# EAGLE design leptonBreakoutV4 (EAGLE 6.6.0)
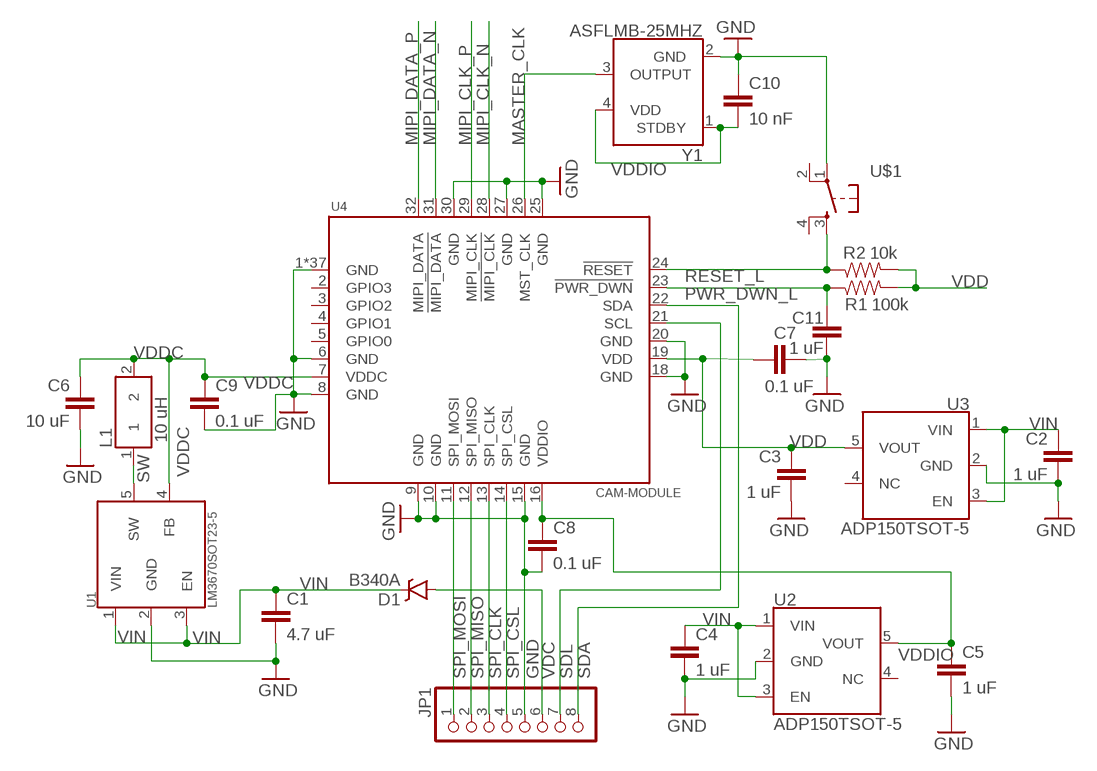
[diagram p0: schematic, sheet 1]

## Parts
C1  4.7 uF  CAP0805  [0805]
C2  1 uF  CAP0805  [0805]
C3  1 uF  CAP0805  [0805]
C4  1 uF  CAP0805  [0805]
C5  1 uF  CAP0805  [0805]
C6  10 uF  CAP0805  [0805]
C7  0.1 uF  CAP0805  [0805]
C8  0.1 uF  CAP0805  [0805]
C9  0.1 uF  CAP0805  [0805]
C10  10 nF  CAP0805  [0805]
C11  1 uF  CAP0805  [0805]
D1  B340A  DIODE-SCHOTTKY-B340A  [SMA-DIODE]
JP1  PINHD-1X8/90  [1X08/90]
L1  10 uH  SMD-INDUCTOR  [SMD-INDUCTOR]
R1  100k  RESISTOR0805-RES  [0805]
R2  10k  RESISTOR0805-RES  [0805]
U1  LM3670SOT23-5  [SOT23-5]
U2  ADP150TSOT-5  [SOT23-5]
U3  ADP150TSOT-5  [SOT23-5]
U4  CAM-MODULE  [CAM-SOCKET]
U$1  TACTILE-SWITCH-7914G  [7914G]
Y1  ASFLMB-25MHZ  [5X3.2-CRYSTAL-OSC]

## Nets
GND: C1.2 C2.2 C3.2 C4.2 C5.2 C6.2 C7.2 C8.2 C9.2 C10.1 C11.2 JP1.5 U1.2(GND) U2.2(GND) U3.2(GND) U4.1(GND) U4.6(GND) U4.8(GND) U4.9(GND) U4.10(GND) U4.15(GND) U4.18(GND) U4.20(GND) U4.25(GND) U4.27(GND) U4.30(GND) U4.P$1(GND) U4.P$2(GND) U4.P$3(GND) U4.P$4(GND) U4.P$5(GND) U4.P$6(GND) U4.P$7(GND) U4.P$8(GND) U4.P$9(GND) U4.P$10(GND) U4.P$11(GND) U4.P$12(GND) U4.P$13(GND) U4.P$14(GND) U4.P$15(GND) U4.P$16(GND) U4.P$17(GND) U4.P$18(GND) U4.P$19(GND) U4.P$20(GND) U4.P$21(GND) U4.P$22(GND) U4.P$23(GND) U4.P$24(GND) U4.P$25(GND) U4.P$26(GND) U4.P$27(GND) U4.P$28(GND) U4.P$29(GND) U4.P$30(GND) U4.P$31(GND) U4.P$32(GND) U4.P$33(GND) U4.P$34(GND) U4.P$35(GND) U4.P$36(GND) U$1.1 Y1.2(GND)
MASTER_CLK: U4.26(MST_CLK) Y1.3(OUTPUT)
MIPI_CLK_N: U4.28(!MIPI_CLK)
MIPI_CLK_P: U4.29(MIPI_CLK)
MIPI_DATA_N: U4.31(!MIPI_DATA)
MIPI_DATA_P: U4.32(MIPI_DATA)
PWR_DWN_L: C11.1 R1.1 U4.23(!PWR_DWN)
RESET_L: R2.1 U4.24(!RESET) U$1.3
SDA: JP1.8 U4.22(SDA)
SDL: JP1.7 U4.21(SCL)
SPI_CLK: JP1.3 U4.13(SPI_CLK)
SPI_CSL: JP1.4 U4.14(SPI_CSL)
SPI_MISO: JP1.2 U4.12(SPI_MISO)
SPI_MOSI: JP1.1 U4.11(SPI_MOSI)
SW: L1.1 U1.5(SW)
VDC: D1.A JP1.6
VDD: C3.1 C7.1 R1.2 R2.2 U3.5(VOUT) U4.19(VDD)
VDDC: C6.1 C9.1 L1.2 U1.4(FB) U4.7(VDDC)
VDDIO: C5.1 C8.1 C10.2 U2.5(VOUT) U4.16(VDDIO) Y1.1(STDBY) Y1.4(VDD)
VIN: C1.1 C2.1 C4.1 D1.C U1.1(VIN) U1.3(EN) U2.1(VIN) U2.3(EN) U3.1(VIN) U3.3(EN)
Unconnected: U2.4(NC) U3.4(NC) U4.2(GPIO3) U4.3(GPIO2) U4.4(GPIO1) U4.5(GPIO0) U$1.2 U$1.4

## Notes on the sheet
- C:/Users/User/Desktop/test.bmp | C:/Users/User/Desktop/test.bmp

## Library data of the parts
C1-C11 = SparkFun-Capacitors:CAP: Capacitor Standard 0603 ceramic capacitor, and 0.1" leaded capacitor.
D1 = leptonCustom:DIODE-SCHOTTKY: Schottky diodes in SFE's production catalog BAT20J 1A 23V 0.62Vf RB751 120mA 40V 0.37Vf PMEG4005EJ 0.5A 40V 0.42Vf MBRA140 1A 40V 0.5Vf B340A 3A 40V SMA; PROD_ID: DIO-09886
JP1 = pinhead:PINHD-1X8: PIN HEADER
L1 = leptonCustom:SMD-INDUCTOR
R1 R2 = SparkFun-Resistors:RESISTOR: Resistor Basic schematic elements and footprints for 0603, 1206, and PTH resistors.
U1 = leptonCustom:LM3670: LM3670 1.2V 350mA Mini Buck Converter TI LM3670MF-1.2/NOPB
U2 U3 = leptonCustom:ADP150: ADP150 2.8V 150mA Linear LDO Regulator Analog Devices ADP150AUJZ-2.8-R7
U4 = leptonCustom:CAM-MODULE: FLIR Lepton 80x60 LWIR camera module.
U$1 = GeekAmmo:TACTILE-SWITCH: Tactile Switch 4 Pins, SPST NO
Y1 = leptonCustom:ASFLMB-25MHZ: 25 MHz crystal oscillator.

## Board
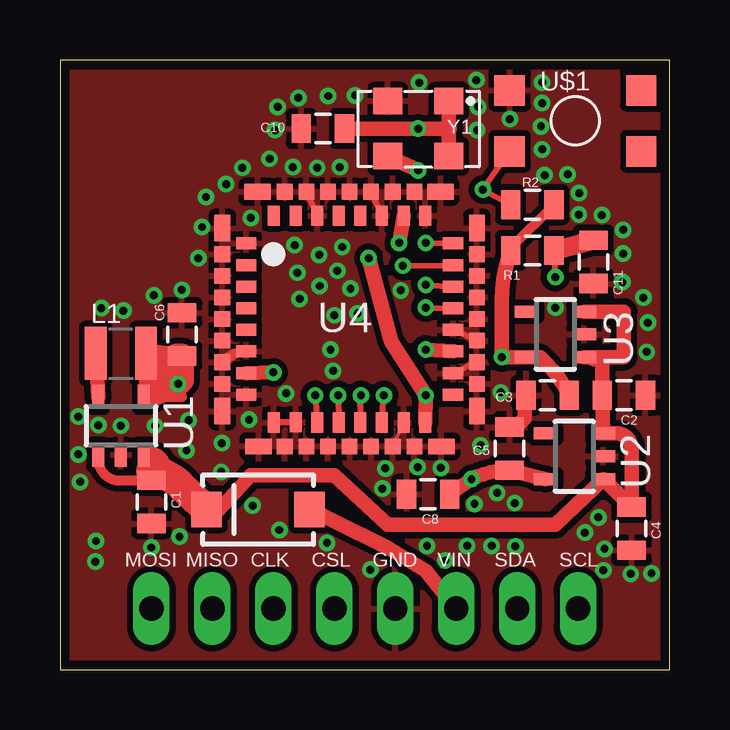
[diagram p1: board, top side]
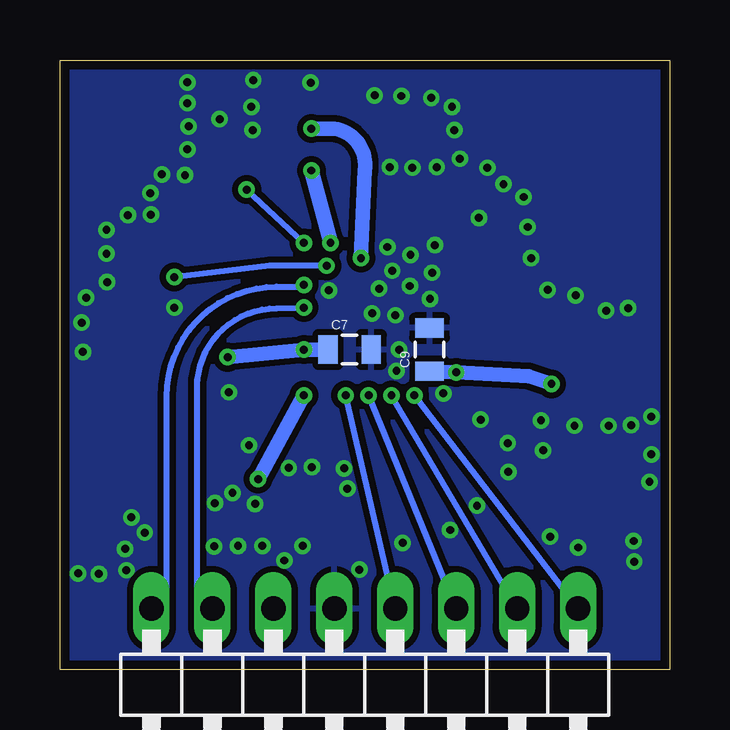
[diagram p2: board, bottom side, seen from below]

Size 25.4 x 25.4 mm. Coordinates in mm from the lower left corner, seen from the top.
Outline: 0,0 25.4,0 25.4,25.4 0,25.4 0,0
Copper layers (1*16): Top 0.0356mm / dielectric 1.5011mm / Bottom 0.0356mm
Design rules "LaenPCBOrder *": minimum track width 6mil, minimum drill 13mil, track to track 6mil, track to pad 6mil, pad to pad 6mil, via to via 6mil, smd to smd 6mil, copper to edge 15mil, drill to drill 6mil, minimum pad ring 7mil, minimum via ring 7mil, stop-mask expansion 3mil, vias tented up to drill 13mil, thermal gap 10mil

### Footprints (pad centres in the part's own frame; a part is rotated, then mirrored left to right if it is on the bottom)
0805 = smd 0.8 x 1.2: 1 -0.9,0; 2 0.9,0
SMA-DIODE = smd 1.27 x 1.47: A -2.15,0; C 2.15,0
1X08/90 = drill 1.016 long: 1 -8.89,-3.81; 2 -6.35,-3.81; 3 -3.81,-3.81; 4 -1.27,-3.81; 5 1.27,-3.81; 6 3.81,-3.81; 7 6.35,-3.81; 8 8.89,-3.81
SMD-INDUCTOR = smd 0.9 x 2.2: 1 -1.05,0; 2 1.05,0
SOT23-5 = smd 0.5 x 1: 1 -0.95,-1.2; 2 0,-1.2; 3 0.95,-1.2; 4 0.95,1.2; 5 -0.95,1.2
CAM-SOCKET = smd 0.5 x 0.84: 1 -3.15,-4.31; 2 -2.25,-4.31; 3 -1.35,-4.31; 4 -0.45,-4.31; 5 0.45,-4.31; 6 1.35,-4.31; 7 2.25,-4.31; 8 3.15,-4.31; 17 3.15,4.31; 18 2.25,4.31; 19 1.35,4.31; 20 0.45,4.31; 21 -0.45,4.31; 22 -1.35,4.31; 23 -2.25,4.31; 24 -3.15,4.31 | smd 0.84 x 0.5: 9 4.31,-3.15; 10 4.3,-2.25; 11 4.31,-1.35; 12 4.31,-0.45; 13 4.31,0.45; 14 4.31,1.35; 15 4.31,2.25; 16 4.31,3.15; 25 -4.31,3.15; 26 -4.31,2.25; 27 -4.31,1.35; 28 -4.31,0.45; 29 -4.31,-0.45; 30 -4.31,-1.35; 31 -4.31,-2.25; 32 -4.31,-3.15 | smd 0.65 x 0.65: P$1 -5.305,2.7; P$3 -5.305,1.8; P$4 -5.305,0.9; P$5 -5.305,0; P$6 -5.305,-0.9; P$7 -5.305,-1.8; P$8 -5.305,-2.7; P$11 -2.7,5.305; P$12 -1.8,5.305; P$13 -0.9,5.305; P$14 0,5.305; P$15 0.9,5.305; P$16 1.8,5.305; P$17 2.7,5.305; P$20 5.305,-2.7; P$21 5.305,-1.8; P$22 5.305,-0.9; P$23 5.305,0; P$24 5.305,0.9; P$25 5.305,1.8; P$26 5.305,2.7; P$29 -2.7,-5.305; P$30 -1.8,-5.305; P$31 -0.9,-5.305; P$32 0,-5.305; P$33 0.9,-5.305; P$34 1.8,-5.305; P$35 2.7,-5.305 | smd 0.65 x 1.1: P$2 -5.305,-3.83; P$9 -5.305,3.79; P$19 5.305,3.83; P$27 5.305,-3.79 | smd 1.1 x 0.65: P$10 3.83,5.305; P$18 -3.79,5.305; P$28 3.83,-5.305; P$36 -3.79,-5.305
7914G = smd 1.27 x 1.27: 1 0,0; 2 0,5.486; 3 2.54,0; 4 2.54,5.486
5X3.2-CRYSTAL-OSC = smd 1.2 x 1.1: 1 -1.27,-1.15; 2 1.27,-1.15; 3 1.27,1.15; 4 -1.27,1.15

### Placement (x,y rotation side)
C1  3.81,6.99 270 top
C2  23.5,11.43 0 top
C3  20.32,11.43 180 top
C4  23.81,5.87 270 top
C5  18.73,9.21 90 top
C6  5.08,13.97 90 top
C7  13.34,13.34 0 bottom
C8  15.34,7.3 180 top
C9  10,13.34 90 bottom
C10  10.95,22.54 0 top
C11  22.23,16.99 270 top
D1  8.26,6.67 180 top
JP1  12.7,-1.27 180 bottom
L1  2.54,13.18 0 top
R1  19.68,17.46 180 top
R2  19.68,19.37 0 top
U1  2.54,10.16 0 top
U2  21.43,8.89 90 top
U3  20.64,13.97 90 top
U4  12.06,14.61 270 top
U$1  18.73,24.13 270 top
Y1  14.92,22.54 180 top

### Tracks (layer width: path | path; a pad name or v marks a point on that pad's centre or on a via)
GND  (via drill 0.33, 0.33 pad 0.61)
  Top 0.152: U4.P$25 U4.15
  Top 0.254: U4.20 U4.P$15 | U4.10 U4.9 | U4.27 U4.P$4 | U4.30 U4.P$7 | U4.18 U4.P$16
  Top 0.406: U4.P$34 arc-45 U4.6
  Top 0.61: 19.05,10.16 19.37,10.48 19.37,11.43
  other vias: 20.64,15.08 2.54,10.16 9.78,17.68 7.59,20.91 9.7,20.94 11.18,23.9 12.29,23.93 11.76,17.61 12.1,15.88 23.44,16.14 23.46,17.34 23.46,18.33 21.15,20.64 20.09,21.67 21.62,18.95 20.19,20.61 20.09,23.6 24.31,15.5 20.04,22.64 20.09,24.47 24.5,14.46 5.36,10.39 6.74,9.44 1.5,5.36 1.47,4.5 3.81,5.09 22.43,6.34 22.64,4.14 6.08,19.69 9.89,16.54 11.27,13.34 11.43,14.76 0.84,7.82 1.6,10.19 0.76,8.97 0.76,10.54 3.91,15.6 1.73,15.06 2.64,14.96 8.03,6.83 9.14,5.82 11.13,5.28 15.29,5.16 16.97,5.16 16.05,4.55 18.21,7.37 17.53,9.35 9.07,23.44 4.98,5.54 5.77,17.14 5.92,18.44 5.08,15.82 7.87,10.41 7.95,18.82 14.2,15.8 12.4,14.84 6.72,8.24 3.96,10.16 21.87,5.71 24.64,4.01 14.96,24.46 17.35,24.56 17.42,23.44 10.72,20.91 11.66,20.94 6.92,20.22 8.97,22.48 9.93,23.83 24.45,13.24 5.27,9.13 8.74,21.29 17.37,22.48 18.75,22.94 21.63,19.85 22.57,18.94 18.36,11.56 17.27,6.91 10.79,17.28 11.56,16.62 10.82,15.98 9.98,15.45 9.42,11.51 11.38,12.45 13.56,8.38 14.9,8.43 15.87,8.41 13.43,7.54 18.95,6.93 22.69,5.03 23.78,3.99 18.97,5.13 17.98,5.16 12.93,4.17
  pour Top (isolate 0.254): 0,0 0,25.4 25.4,25.4 25.4,0
  pour Bottom (isolate 0.254): 0,25.4 25.4,25.4 25.4,0 0,0
MASTER_CLK  (via drill 0.33 pad 0.61)
  Top 0.61: v14.92,20.8 Y1.3 | v14.13,17.78 U4.26
  Bottom 0.61: v14.13,17.78 v14.92,20.8
PWR_DWN_L  (via drill 0.33)
  Top 0.254: R1.1 v20.64,16.35 | v14.29,16.83 U4.23
  Top 0.813: R1.1 C11.1
  Bottom 0.254: v14.29,16.83 16.67,16.83 v20.64,16.35
RESET_L  (via drill 0.33)
  Top 0.254: R2.1 v17.62,20 U$1.3 | v15.24,17.78 U4.24
  Bottom 0.254: v15.24,17.78 v17.62,20
SDA  (via drill 0.33 pad 0.61)
  Top 0.254: v15.24,16.03 U4.22
  Bottom 0.254: JP1.8 20.95,2.54 20.95,11.37 arc90 U4.22 15.48,15.95 arc-90 v15.24,16.03
SDL  (via drill 0.33 pad 0.61)
  Top 0.254: v15.24,15.08 U4.21
  Bottom 0.254: JP1.7 19.68,2.54 19.68,11.74 arc90 U4.21 v15.24,15.08
SPI_CLK  (via drill 0.33)
  Top 0.254: v12.54,11.43 12.52,10.98 U4.13
  Bottom 0.254: JP1.3 v12.54,11.43
SPI_CSL  (via drill 0.33)
  Top 0.254: U4.14 v13.49,11.43
  Bottom 0.254: JP1.4 v13.49,11.43
SPI_MISO  (via drill 0.33)
  Top 0.254: 11.62,10.61 U4.12 v11.59,11.43
  Bottom 0.254: JP1.2 v11.59,11.43
SPI_MOSI  (via drill 0.33)
  Top 0.254: v10.64,11.43 U4.11
  Bottom 0.254: JP1.1 v10.64,11.43
SW
  Top 0.61: U1.5 L1.1
VDC
  Top 0.61: D1.A 10.4,7.07 10.85,6.46 11.35,6.23 13.65,5.08 15.24,4.13 JP1.6
VDD  (via drill 0.33)
  Top 0.254: R1.2 18.79,17.57
  Top 0.406: 18.79,17.57 R2.2
  Top 0.61: 20,13.02 U3.5 v18.41,13.02 | 20,13.02 v18.41,13.02 | 20,13.02 20.32,12.7 arc-19 C3.1 | v18.41,13.02 18.41,15.4 arc-20 R1.2 | U4.19 v15.24,13.33
  Bottom 0.61: C7.1 v15.24,13.33 v18.41,13.02
VDDC  (via drill 0.33)
  Top 0.406: U1.4 5.08,11.36 v4.92,11.91 | U4.7 7.91,12.35
  Top 0.61: v8.89,12.38 U4.7
  Top 0.813: L1.2 5.08,13.02
  Top 1.016: 3.81,12.06 3.81,12.7 5.08,12.06 | 3.81,12.06 3.81,11.43 v4.92,11.91 5.08,12.06 | 5.08,12.06 5.08,13.02 C6.1 4.86,13.07 | 3.81,12.06 5.08,12.06
  Bottom 0.61: v4.92,11.91 5.87,12.22 v8.89,12.38 C9.1
VDDIO  (via drill 0.33)
  Top 0.254: 15.21,11.4 v15.24,11.43
  Top 0.61: v12.86,17.14 13.81,13.65 v15.24,11.43 U4.16 | Y1.1 16.19,22.54 | 16.19,22.54 Y1.4 | v14.92,22.54 16.19,22.54 | C8.1 v17.14,7.94 arc-26 C5.1 U2.5 | v14.92,22.54 16.25,22.54 | v14.92,22.54 C10.2
  Bottom 0.61: v15.24,11.43 v17.14,7.94 | v12.86,17.14 12.7,20.8 arc-90 13.97,22.54 v14.92,22.54
VIN
  Top 0.254: 22.59,12.82 arc-90 U3.1
  Top 0.406: U1.1 arc90 2.35,7.88 C1.1 | C1.1 arc213 U1.3 | C1.1 3.81,8.25 | 22.59,11.16 C2.1
  Top 0.61: 22.59,12.82 C2.1 U2.3 arc90 22.47,9.84 23.18,9.84 arc-90 23.81,9.21 C4.1 22.65,7.94 U2.1 20.64,6.03 13.65,6.03 11.43,8.1 7.94,8.1 6.35,6.35 | U3.1 23.5,13.02 23.5,14.92 U3.3
  Top 0.813: 6.35,6.35 D1.C
  Top 1.27: D1.C 5.08,7.62 arc43 3.81,8.25

### Text on the board
tPlace: MOSI | MISO | CLK | CSL | GND | VIN | SDA | SCL | C:/Users/User/Desktop/test.bmp | C:/Users/User/Desktop/test.bmp